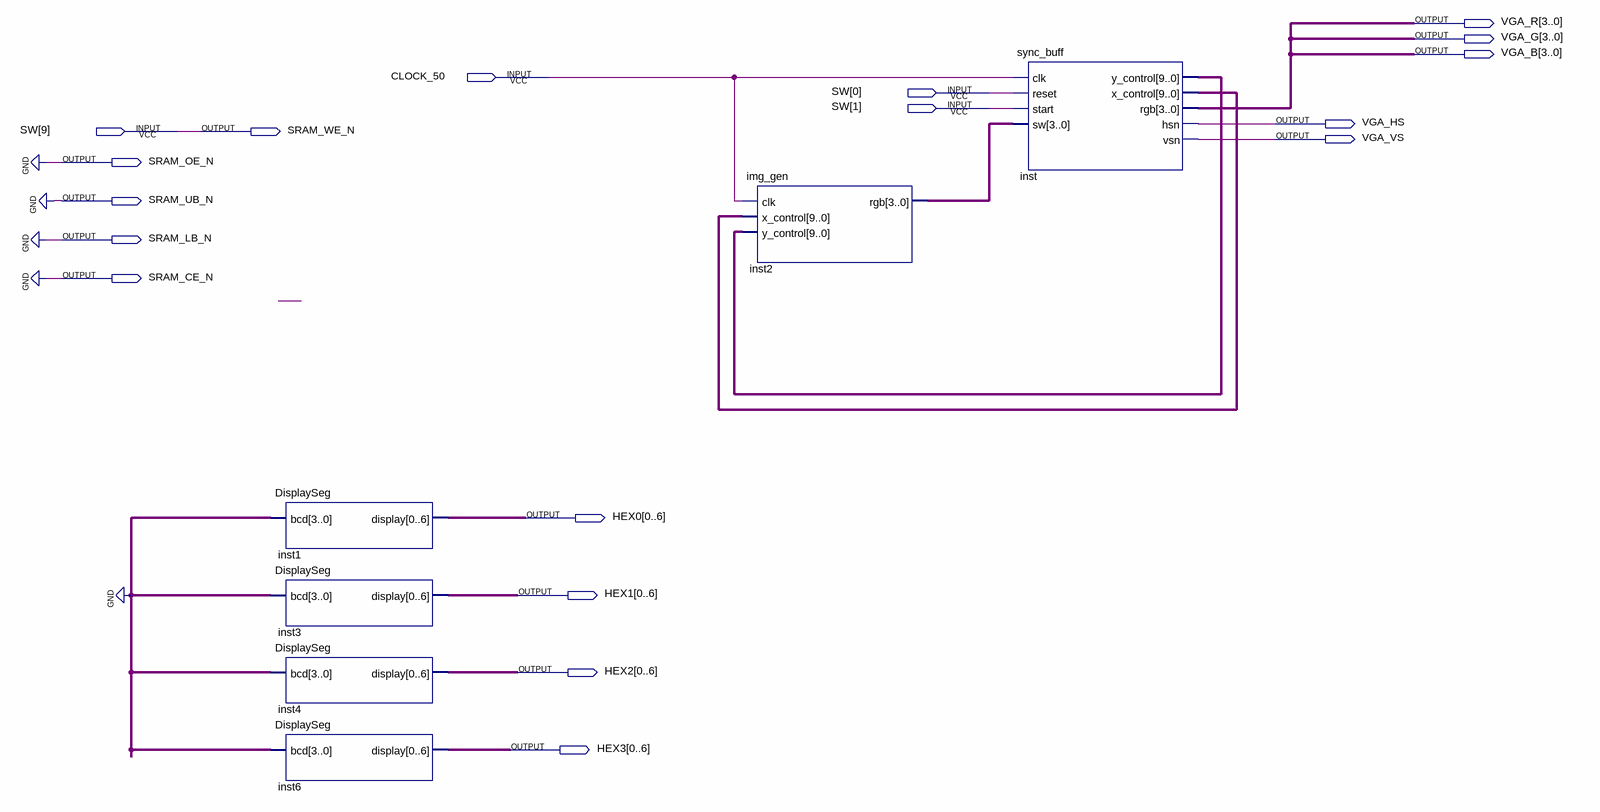
[diagram p0: schematic sheet]
// Quartus schematic Display.bdf as structural Verilog: 6 symbols, 18 pins
module Display (
  input  CLOCK_50,
  input  [9:0] SW,
  output [3:0] VGA_R,
  output [3:0] VGA_G,
  output [3:0] VGA_B,
  output VGA_HS,
  output SRAM_WE_N,
  output VGA_VS,
  output SRAM_OE_N,
  output SRAM_UB_N,
  output SRAM_LB_N,
  output SRAM_CE_N,
  output [0:6] HEX0,
  output [0:6] HEX1,
  output [0:6] HEX2,
  output [0:6] HEX3
);

  wire [3:0] inst2_rgb;
  wire [9:0] inst_x_control, inst_y_control;

  DisplaySeg inst1 (.bcd(4'b0000), .display(HEX0));
  DisplaySeg inst3 (.bcd(4'b0000), .display(HEX1));
  DisplaySeg inst4 (.bcd(4'b0000), .display(HEX2));
  DisplaySeg inst6 (.bcd(4'b0000), .display(HEX3));
  img_gen inst2 (.clk(CLOCK_50), .x_control(inst_x_control), .y_control(inst_y_control), .rgb(inst2_rgb));
  sync_buff inst (
    .clk(CLOCK_50), .reset(SW[0]), .start(SW[1]), .sw(inst2_rgb), .y_control(inst_y_control),
    .x_control(inst_x_control), .rgb(VGA_B), .hsn(VGA_HS), .vsn(VGA_VS));

  assign SRAM_CE_N = 1'b0;
  assign SRAM_LB_N = 1'b0;
  assign SRAM_OE_N = 1'b0;
  assign SRAM_UB_N = 1'b0;
  assign SRAM_WE_N = SW[9];
  assign VGA_G = VGA_B;
  assign VGA_R = VGA_B;
endmodule
